# Altium project WPT Round 1.PrjPcb
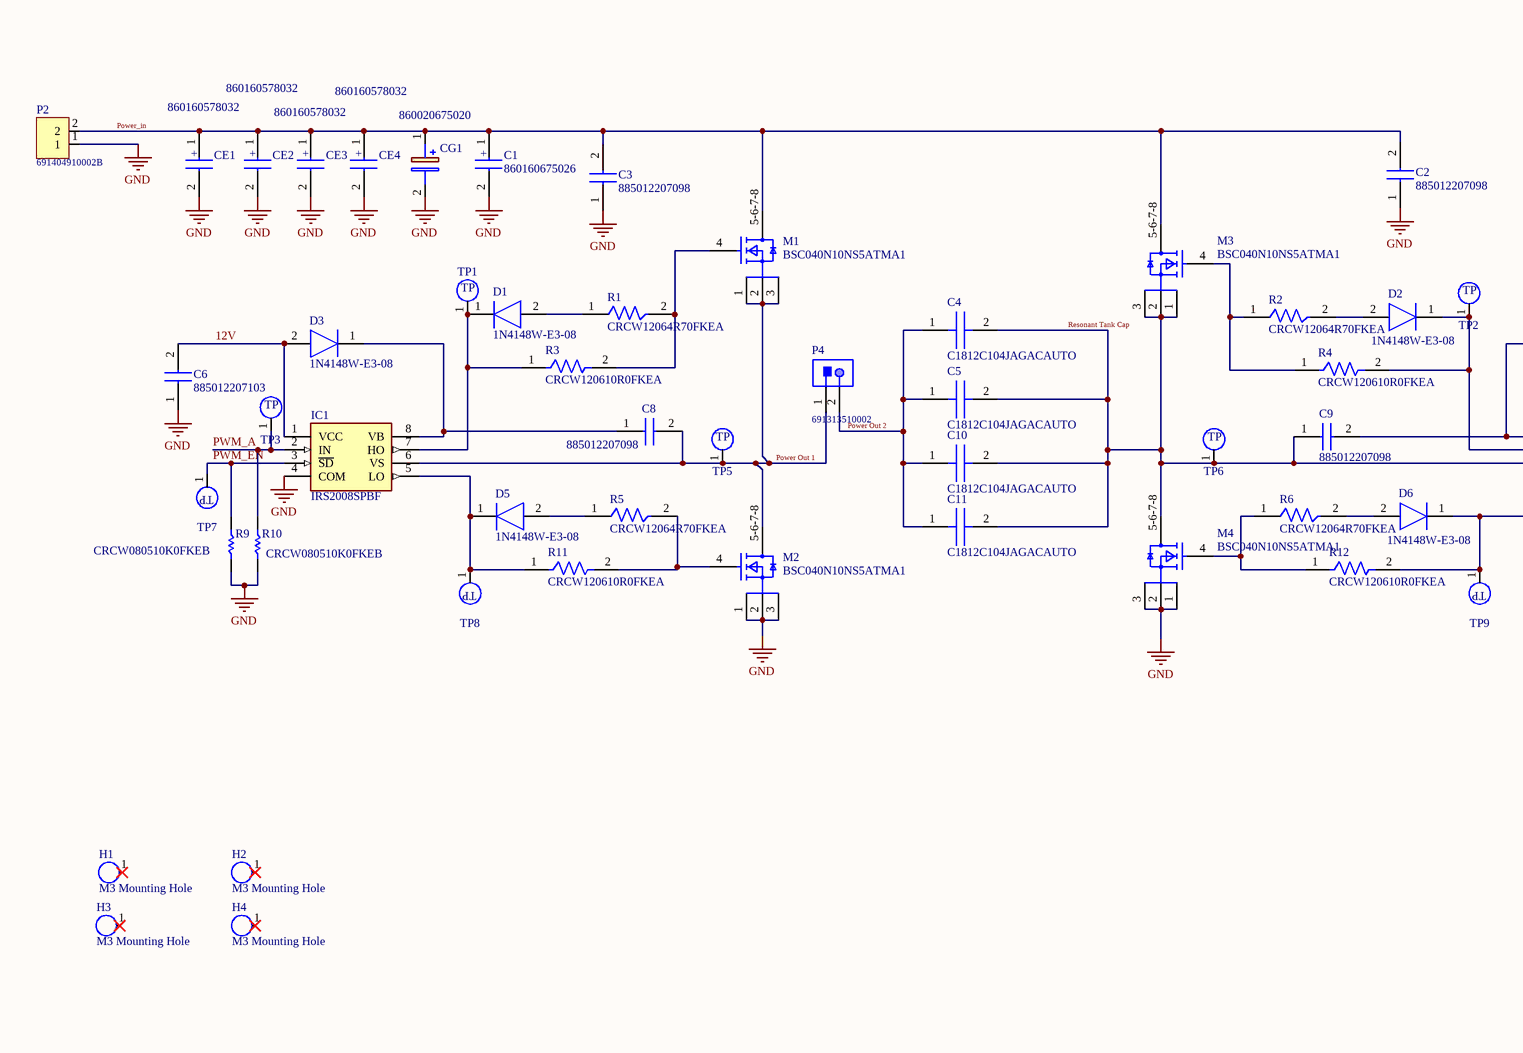
[diagram p0: Schematics.SchDoc, left]
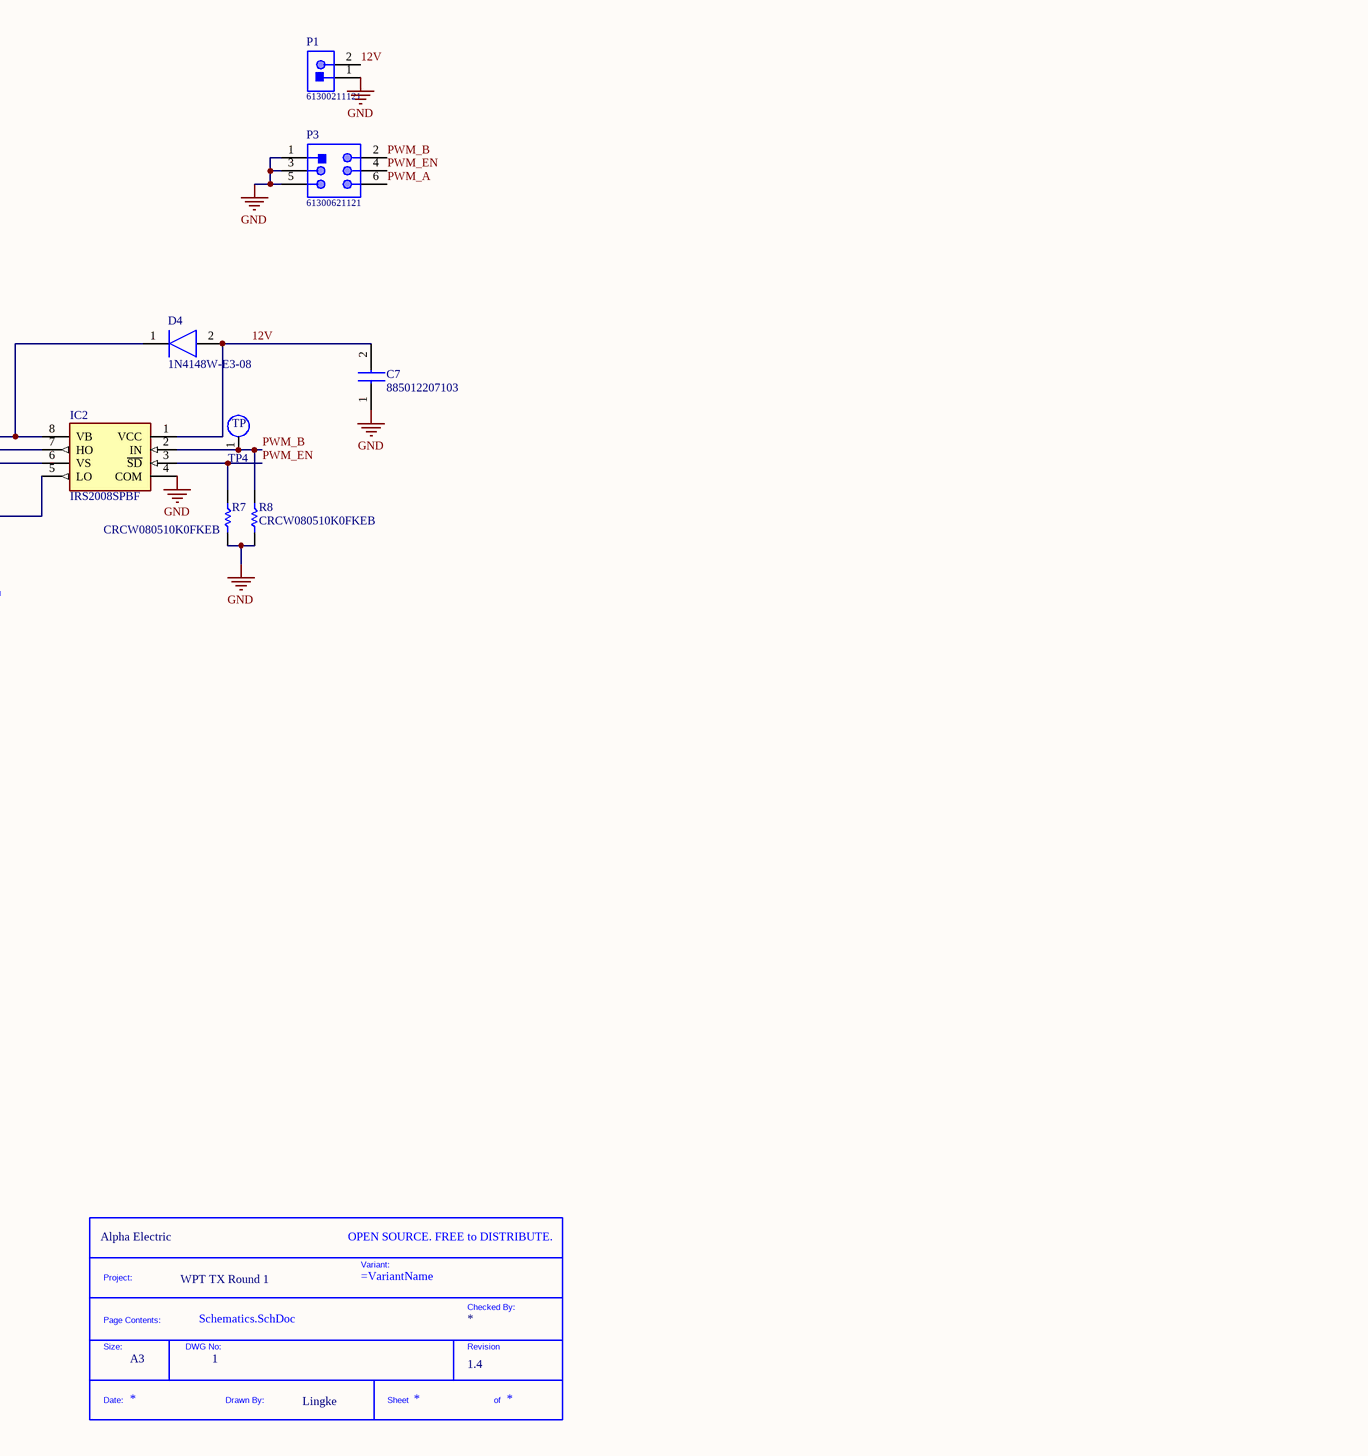
[diagram p1: Schematics.SchDoc, middle]
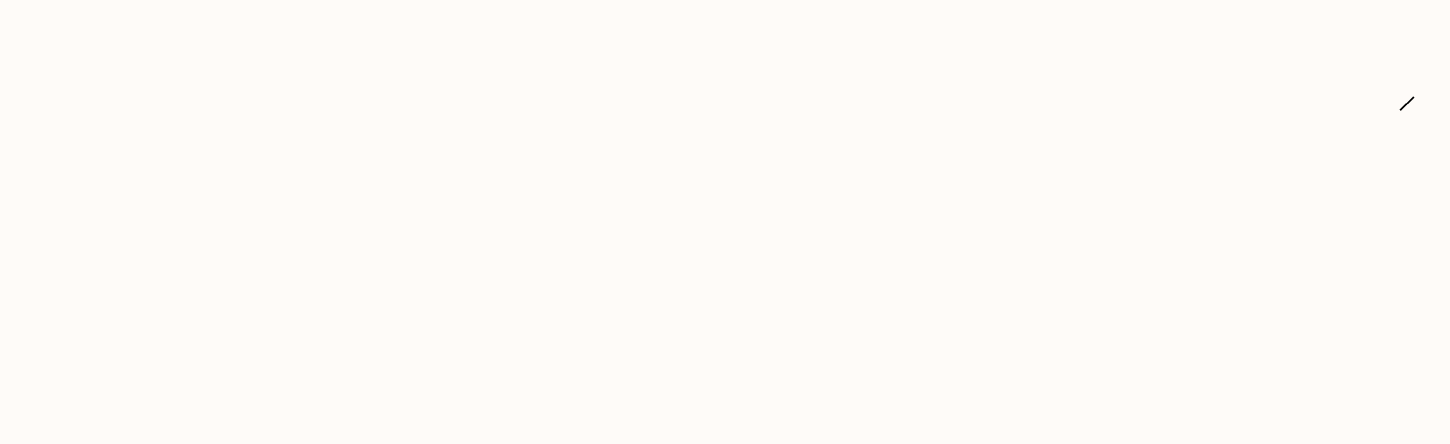
[diagram p2: Schematics.SchDoc, right]
1 sheet, 58 parts. Net scope: global (net labels, ports and power ports of the same name join across sheets).
Board file: Layout.PcbDoc

## Sheet Schematics.SchDoc
size A3

### Parts
*  Project Name: WPT TX Round 1  Company: Alpha Electric  Drawn By: Lingke  Revision: 1.4  DWG No: 1  Size: A3  (hidden comment: Title_Block)  (graphical)
C1  860160675026  [CAPPRD500W62D1000H1750]
C2  885012207098  [CAPC2012X90N]
C3  885012207098  [CAPC2012X90N]
C4  C1812C104JAGACAUTO  [CAPC4532X220N]
C5  C1812C104JAGACAUTO  [CAPC4532X220N]
C6  885012207103  [CAPC2012X135N]
C7  885012207103  [CAPC2012X135N]
C8  885012207098  [CAPC2012X90N]
C9  885012207098  [CAPC2012X90N]
C10  C1812C104JAGACAUTO  [CAPC4532X220N]
C11  C1812C104JAGACAUTO  [CAPC4532X220N]
CE1  860160578032  [CAPPRD500W62D1300H2650]
CE2  860160578032  [CAPPRD500W62D1300H2650]
CE3  860160578032  [CAPPRD500W62D1300H2650]
CE4  860160578032  [CAPPRD500W62D1300H2650]
CG1  860020675020  [CAPPRD500W62D1000H1400]
D1  1N4148W-E3-08  [SOD3716X135N]
D2  1N4148W-E3-08  [SOD3716X135N]
D3  1N4148W-E3-08  [SOD3716X135N]
D4  1N4148W-E3-08  [SOD3716X135N]
D5  1N4148W-E3-08  [SOD3716X135N]
D6  1N4148W-E3-08  [SOD3716X135N]
H1  M3 Mounting Hole  [M3 Hole]
H2  M3 Mounting Hole  [M3 Hole]
H3  M3 Mounting Hole  [M3 Hole]
H4  M3 Mounting Hole  [M3 Hole]
IC1  IRS2008SPBF  [SOIC127P600X175-8N]
IC2  IRS2008SPBF  [SOIC127P600X175-8N]
M1  BSC040N10NS5ATMA1  [FP-PG-TDSON-8-MFG]
M2  BSC040N10NS5ATMA1  [FP-PG-TDSON-8-MFG]
M3  BSC040N10NS5ATMA1  [FP-PG-TDSON-8-MFG]
M4  BSC040N10NS5ATMA1  [FP-PG-TDSON-8-MFG]
P1  61300211121  [61300211121]
P2  691404910002B  [691404910002B]
P3  61300621121  [61300621121]
P4  691313510002  [691313510002]
R1  CRCW12064R70FKEA  [FP-CRCW1206-e3-IPC_A]
R2  CRCW12064R70FKEA  [FP-CRCW1206-e3-IPC_A]
R3  CRCW120610R0FKEA  [FP-CRCW1206-e3-IPC_A]
R4  CRCW120610R0FKEA  [FP-CRCW1206-e3-IPC_A]
R5  CRCW12064R70FKEA  [FP-CRCW1206-e3-IPC_A]
R6  CRCW12064R70FKEA  [FP-CRCW1206-e3-IPC_A]
R7  CRCW080510K0FKEB  [RESC2013X50X30ML20T20]
R8  CRCW080510K0FKEB  [RESC2013X50X30ML20T20]
R9  CRCW080510K0FKEB  [RESC2013X50X30ML20T20]
R10  CRCW080510K0FKEB  [RESC2013X50X30ML20T20]
R11  CRCW120610R0FKEA  [FP-CRCW1206-e3-IPC_A]
R12  CRCW120610R0FKEA  [FP-CRCW1206-e3-IPC_A]
TP1  TP  [Test Point]  (value not drawn)  (no BOM)
TP2  TP  [Test Point]  (value not drawn)  (no BOM)
TP3  TP  [Test Point]  (value not drawn)  (no BOM)
TP4  TP  [Test Point]  (value not drawn)  (no BOM)
TP5  TP  [Test Point]  (value not drawn)  (no BOM)
TP6  TP  [Test Point]  (value not drawn)  (no BOM)
TP7  TP  [Test Point]  (value not drawn)  (no BOM)
TP8  TP  [Test Point]  (value not drawn)  (no BOM)
TP9  TP  [Test Point]  (value not drawn)  (no BOM)

### Nets
GND: C1.2(-) C2.1 C3.1 C6.1 C7.1 CE1.2(-) CE2.2(-) CE3.2(-) CE4.2(-) CG1.2(-) IC1.4(COM) IC2.4(COM) M2.1(S) M2.2(S) M2.3(S) M4.1(S) M4.2(S) M4.3(S) P1.1 P2.1 P3.1 P3.3 P3.5 R7.1 R8.1 R9.1 R10.1
12V: C6.2 C7.2 D3.2(A) D4.2(A) IC1.1(VCC) IC2.1(VCC) P1.2
Power Out 1: C8.2 IC1.6(VS) M1.1(S) M1.2(S) M1.3(S) M2.5-6-7-8(D) P4.1 TP5.1(TP)
Power Out 2: C4.1 C5.1 C10.1 C11.1 P4.2
Power_in: C1.1(+) C2.2 C3.2 CE1.1(+) CE2.1(+) CE3.1(+) CE4.1(+) CG1.1(+) M1.5-6-7-8(D) M3.5-6-7-8(D) P2.2
PWM_A: IC1.2(IN) P3.6 R10.2 TP3.1(TP)
PWM_B: IC2.2(IN) P3.2 R8.2 TP4.1(TP)
PWM_EN: IC1.3(~{SD}) IC2.3(~{SD}) P3.4 R7.2 R9.2 TP7.1(TP)
Resonant Tank Cap: C4.2 C5.2 C9.1 C10.2 C11.2 IC2.6(VS) M3.1(S) M3.2(S) M3.3(S) M4.5-6-7-8(D) TP6.1(TP)
NetC8_1: C8.1 D3.1(K) IC1.8(VB)
NetC9_2: C9.2 D4.1(K) IC2.8(VB)
NetD1_1: D1.1(K) IC1.7(HO) R3.1 TP1.1(TP)
NetD1_2: D1.2(A) R1.1
NetD2_1: D2.1(K) IC2.7(HO) R4.2 TP2.1(TP)
NetD2_2: D2.2(A) R2.2
NetD5_1: D5.1(K) IC1.5(LO) R11.1 TP8.1(TP)
NetD5_2: D5.2(A) R5.1
NetD6_1: D6.1(K) IC2.5(LO) R12.2 TP9.1(TP)
NetD6_2: D6.2(A) R6.2
NetM1_4: M1.4(G) R1.2 R3.2
NetM2_4: M2.4(G) R5.2 R11.2
NetM3_4: M3.4(G) R2.1 R4.1
NetM4_4: M4.4(G) R6.1 R12.1

Not connected (* = marked no-connect by the designer): H1 1*; H2 1*; H3 1*; H4 1*

### Notes on the sheet
- (in symbol Title_Block) OPEN SOURCE. FREE to DISTRIBUTE.; Variant:; Project:; Checked By:; Page Contents:; Size:; DWG No:; Revision; Date:; Drawn By:; Sheet; of

### Library data of the parts
* = Title_Block: Standard Title Block.; Checked By: *
C1 = Input Cap 220uF: Capacitor 220uF/50V; Manufacturer_Name: Wurth Elektronik; Height: 17.5mm; Manufacturer_Part_Number: 860160675026; Supplier 1: Mouser; Supplier Part Number 1: 710-860160675026
C2 C3 C8 C9 = Input Cap 100nF: Capacitor 0.1uF/50V X7R; Manufacturer_Name: Wurth Elektronik; Datasheet Link: https://componentsearchengine.com//885012207098.pdf; Height: 0.9mm; Mouser2 Part Number: 710-885012207098; Mouser2 Price/Stock: https://www.mouser.com/Search/Refine.aspx?Keyword=710-885012207098; Manufacturer_Part_Number: 885012207098; Supplier 1: Mouser; Supplier Part Number 1: 710-885012207098
C4 C5 C10 C11 = Resonant Tank Cap: Resistor; Manufacturer_Name: Kemet; Datasheet Link: https://api.kemet.com/component-edge/download/datasheet/C1812C104JAGACAUTO.pdf; Height: 2.2mm; Manufacturer_Part_Number: C1812C104JAGACAUTO; Supplier Part Number 1: 80-C1812C104JAGAUTO; Supplier 1: Mouser
C6 C7 = 12V Fiter Cap: Capacitor; Manufacturer_Name: Wurth Elektronik; Datasheet Link: https://katalog.we-online.com/pbs/datasheet/885012207103.pdf; Height: 1.35mm; Manufacturer_Part_Number: 885012207103; Supplier 1: Mouser; Supplier Part Number 1: 710-885012207103
CE1-CE4 = 1000uF Input Cap: Capacitor 1000uF Input Filtering; Manufacturer_Name: Wurth Elektronik; Datasheet Link: https://katalog.we-online.de/pbs/datasheet/860160578032.pdf; Height: 26.5mm; Manufacturer_Part_Number: 860160578032; Supplier 1: Mouser; Supplier Part Number 1: 710-860160578032
CG1 = Ground Splitting Cap: Capacitor Polarised; Manufacturer_Name: Wurth Elektronik; Height: 14mm; Manufacturer_Part_Number: 860020675020; Supplier 1: Mouser; Supplier Part Number 1: 710-860020675020
D1-D6 = BootStrap Diode: Diode; Manufacturer_Name: Vishay; Datasheet Link: https://componentsearchengine.com//1N4148W-E3-08.pdf; Height: 1.35mm; Mouser2 Part Number: 78-1N4148W-E3-08; Mouser2 Price/Stock: https://www.mouser.com/Search/Refine.aspx?Keyword=78-1N4148W-E3-08; Manufacturer_Part_Number: 1N4148W-E3-08; Supplier 1: Digi-Key; Supplier Part Number 1: 1N4148W-E3-08CT-ND
H1-H4 = M3_Mounting_hole
IC1 IC2 = Gate Driver IC: Integrated Circuit; Manufacturer_Name: Infineon; Height: 1.75mm; Manufacturer_Part_Number: IRS2008SPBF; Supplier 1: Mouser; Supplier Part Number 1: 726-IRS2008SPBF
M1-M4 = Mosfet Switcher: MOSFET N-CH 100V 100A 8TDSON; Manufacturer: Infineon; Threshold Vgs Max: 3.8V; Reverse Recovery Charge: 90nC; Number Of N Channels: 1; Input Capacitace At Vds: 4100pF @ 50V; Turn On Delay Time: 13ns; Drain To Source Resistance: 3.4mΩ; Max Junction Temp: +150°C; Transconductance: 120S; Power Dissipation: 139W; Gate Charge At Vgs: 58nC @ 10V; Threshold Vgs Min: 2.2V; Typ Forward Diode Voltage: 0.9V; Depletion Mode: False; Gate To Source Voltage: 20V; Rthja Max: 50K/W; Pulse Drain Current: 400A; Turn Off Delay Time: 32ns; Max Forward Diode Voltage: 1.1V; Reverse Recovery Time: 54ns; ComponentLink2Description: Datasheet; Temperature Range Low: -55°C; Automotive: No; Number Of Channels: 1; Mouser Description: MOSFET N-Ch 100V 100A TDSON-8; Height: 1.1mm; Temperature Range High: +150°C; Drain To Source Breakdown Voltage: 100V; Temperature: -55°C to +150°C; Device Class L3: MOSFETs; Drain To Source Voltage: 100V; Digikey Description: MOSFET N-CH 100V 100A 8TDSON; Continuous Drain Current: 100A; Package: PG-TDSON-8; Lead Free: Yes; ComponentLink2URL: https://www.infineon.com/dgdl/Infineon-BSC040N10NS5-DS-v02_02-EN.pdf?fileId=5546d4624a0bf290014a0fbcee2e6b38; Manufacturer Part Number: BSC040N10NS5ATMA1; Footprint Url: https://www.infineon.com/dgdl/Infineon-PG-TDSON-8-7-FP-v01_00-EN.pdf?fileId=5546d46259d9a4bf015a1b6adadd1f0a; Device Class L2: Transistors; Category: Trans; RoHS: TRUE; Device Class L1: Discrete Semiconductors; Octopart: https://octopart.com/bsc040n10ns5atma1-infineon-52825711; Supplier 1: Mouser; Supplier Part Number 1: 726-BSC040N10NS5ATMA
P1 = 12V Input: THT Vertical Pin Header WR-PHD, Pitch 2.54 mm, Single Row, 2 pins; Manufacturer: Wurth Elektronik; Rated Current: 3A; Gender: Male; Withstanding Voltage: 500VAC; Working Voltage: 250VAC; Pitch: 2.54mm; Contact Resistance: 20mOhm; Pin Number: 2; Mounting Technology: THT; Orientation: Vertical; Operating Temperature: -40to105degC; Packaging: Bag; Publisher: WurthElektronik; Datasheet URL: https://katalog.we-online.de/em/datasheet/6130xx11121.pdf; Manufacturer URL: http://www.we-online.de; Row Number: Single; Package Reference: 61300211121; Part Number: 61300211121; Supplier 1: Mouser; Supplier Part Number 1: 710-61300211121
P2 = Power Input: Serie 4049 B - 7.50mm Screwless Clamp Power Connector WR-TBL, 2 pin; Manufacturer: Wurth Elektronik; Pin Number: 2; Mounting Technology: THT; Operating Temperature: -40to105degC; Part Number: 691404910002B; Package Reference: 691404910002B; Manufacturer URL: http://www.we-online.de; Publisher: WurthElektronik; Packaging: Box; Datasheet URL: http://katalog.we-online.de/em/datasheet/6914049100xxB.pdf; Pitch: 7.50mm; Supplier Part Number 1: 710-691404910002B; Supplier 1: Mouser
P3 = PWM Input Dual Pin: THT Vertical Pin Header WR-PHD, Pitch 2.54 mm, Dual Row, 6 pins; Manufacturer: Wurth Elektronik; Contact Resistance: 20mOhm; Withstanding Voltage: 500VAC; Pin Number: 6; Gender: Male; Pitch: 2.54mm; Working Voltage: 250VAC; Rated Current: 3A; Packaging: Bag; Row Number: Dual; Manufacturer URL: http://www.we-online.de; Part Number: 61300621121; Operating Temperature: -40to105degC; Mounting Technology: THT; Package Reference: 61300621121; Datasheet URL: https://katalog.we-online.de/em/datasheet/6130xx21121.pdf; Orientation: Vertical; Publisher: WurthElektronik; Supplier Part Number 1: 710-61300621121; Supplier 1: Mouser
P4 = Power Output: Serie 313 - 5.08mm Close Horizontal PCB Header WR-TBL, 2 pin; Manufacturer: Wurth Elektronik; Gender: Male; Pin Number: 2; Publisher: WurthElektronik; Packaging: Box; Part Number: 691313510002; Package Reference: 691313510002; Mounting Technology: THT; Datasheet URL: http://katalog.we-online.de/em/datasheet/6913135100xx.pdf; Pitch: 5.08mm; Operating Temperature: -40to105degC; Manufacturer URL: http://www.we-online.de; Supplier 1: Mouser; Supplier Part Number 1: 710-691313510002
R1 R2 R5 R6 = MOSFET Gate Fast-off Resistor 4.7Ohm: RES Thick Film, 4.7Ω, 1%, 0.25W, 100ppm/°C, 1206; Resistance: 4.7R; Power Rating: 250mW; Voltage Rating: 200V; Length: 3.2mm; Composition: Thick Film; Weight: 0.000353oz; Temperature Coefficient: 100ppm/°C; Height: 0.024inch; Case Code (Imperial): 1206; Width: 0.063inch; Number of Terminations: 2; Case Code (Metric): 3216; Features: Automotive AEC-Q200; Packaging: Tape and Reel; Tolerance: 1%; Contact Plating: Tin; Military Standard: Not; Depth: 1.6mm; Max Operating Temperature: 155°C; Number of Pins: 2; Min Operating Temperature: -55°C; Max Power Dissipation: 250mW; Mount: Surface Mount; Case/Package: 1206; Package Quantity: 10; Radiation Hardening: No; Supplier 1: Mouser; Supplier Part Number 1: 71-CRCW12064R70FKEA
R3 R4 R11 R12 = MOSFET Gate Resistor 10Ohm: RES Thick Film, 10Ω, 1%, 0.25W, 100ppm/°C, 1206; Power Rating: 250mW; Voltage Rating (DC): 200V; Resistance: 10R; Number of Terminations: 2; Width: 0.063inch; Case Code (Imperial): 1206; Depth: 1.6mm; Contact Plating: Tin; Radiation Hardening: No; Lead Free: Lead Free; Length: 3.2mm; Tolerance: 1%; Max Power Dissipation: 250mW; Composition: Thick Film; Weight: 0.000353oz; Case/Package: 1206; Number of Pins: 2; Package Quantity: 10; Min Operating Temperature: -55°C; Military Standard: Not; Max Operating Temperature: 155°C; Termination: SMD/SMT; Case Code (Metric): 3216; Voltage Rating: 200V; Height: 0.55mm; Features: Automotive AEC-Q200; Temperature Coefficient: 100ppm/°C; Packaging: Tape and Reel; Supplier 1: Digi-Key; Supplier Part Number 1: 541-10.0FDKR-ND
R7-R10 = PWM Pull Down Resistor: Manufacturer: Vishay Dale; Part Number: CRCW080510K0FKEB; Supplier 1: Mouser; Supplier Part Number 1: 71-CRCW080510K0FKEB
TP1-TP9 = Test Point: Test Point 1mm by 1mm